# Altium schematic sheet MotherBoard.SchDoc: Motherboard
size A4; CheckedBy: DMH; Organization: Detex Corp; Address1: Detex Corp; Address2: 302 Detex Dr; Address3: New Braunfels, TX 78130; Address4: (830) 629-290; DocumentNumber: 107027; Revision: A1; SheetNumber: 3; SheetTotal: 5; ProjectName: EE Project - 1.17.2021.PrjPcb
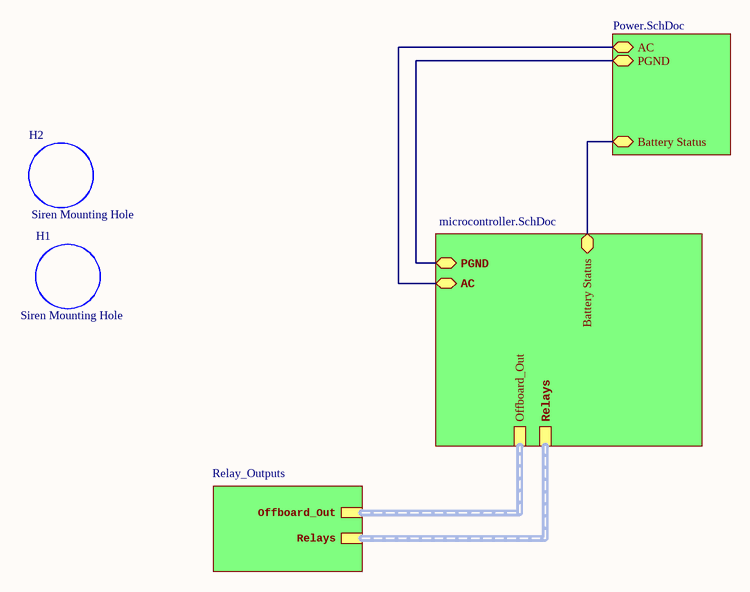
[diagram p0: MotherBoard.SchDoc]

## Parts
H1  Siren Mounting Hole  [Siren Mount Hole]  (no BOM)
H2  Siren Mounting Hole  [Siren Mount Hole]  (no BOM)

## Sub-sheets
Relay_Outputs = Relay_Outputs.SchDoc: Offboard_Out (harness Offboard_Out), Relays (harness Relays)
U_microcontroller = microcontroller.SchDoc: Battery Status (bidir), Offboard_Out (harness Offboard_Out), Relays (harness Relays), AC (bidir), PGND (bidir)
U_Power = Power.SchDoc: AC (bidir), PGND (bidir), Battery Status (bidir)

## Nets
(unnamed): sheet U_Power/AC, sheet U_microcontroller/AC
(unnamed): sheet U_Power/PGND, sheet U_microcontroller/PGND
(unnamed): sheet U_Power/Battery Status, sheet U_microcontroller/Battery Status

## Buses and harness runs
harness sheet Relay_Outputs/Offboard_Out = sheet U_microcontroller/Offboard_Out
harness sheet Relay_Outputs/Relays = sheet U_microcontroller/Relays

## Notes on the sheet
- Title
- Size:
- Date:
- A4
- Number:
- Time:
- Revision:
- Sheet
- of
- Detex Corporation
- 302 Detex Drive
- New Braunfels, TX
- 78130
- (830) 629-2900
- File: